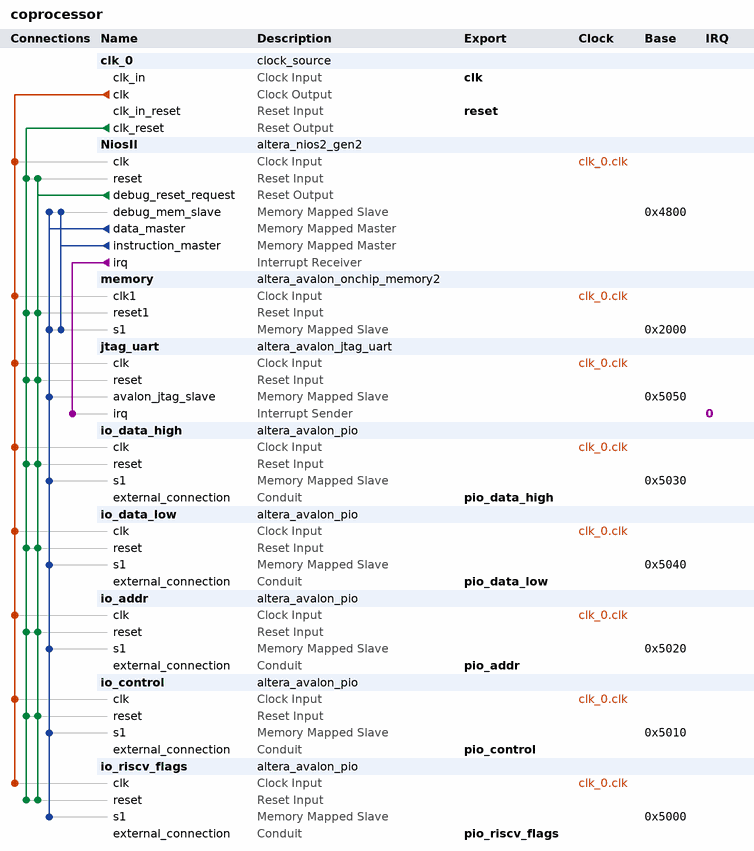
[diagram p0: system contents]
# Platform Designer (Qsys) system coprocessor, Cyclone IV E EP4CE22F17C6
# Parameters at their usual value, and those the tool derives, are not listed.
package require -exact qsys 20.1
create_system coprocessor
set_project_property DEVICE_FAMILY {Cyclone IV E}
set_project_property DEVICE EP4CE22F17C6

add_instance clk_0 clock_source 20.1
set_instance_parameter_value clk_0 clockFrequency 50000000

add_instance NiosII altera_nios2_gen2 20.1
set_instance_parameter_value NiosII dcache_size 2048
set_instance_parameter_value NiosII exceptionSlave memory.s1
set_instance_parameter_value NiosII icache_size 4096
set_instance_parameter_value NiosII impl Tiny
set_instance_parameter_value NiosII resetSlave memory.s1

add_instance memory altera_avalon_onchip_memory2 20.1
set_instance_parameter_value memory dataWidth 32
set_instance_parameter_value memory dualPort false
set_instance_parameter_value memory initMemContent false
set_instance_parameter_value memory initializationFileName onchip_mem.hex
set_instance_parameter_value memory memorySize 6144

add_instance jtag_uart altera_avalon_jtag_uart 20.1
set_instance_parameter_value jtag_uart simInteractiveOptions NO_INTERACTIVE_WINDOWS

add_instance io_data_high altera_avalon_pio 20.1
set_instance_parameter_value io_data_high direction InOut
set_instance_parameter_value io_data_high width 32

add_instance io_data_low altera_avalon_pio 20.1
set_instance_parameter_value io_data_low direction InOut
set_instance_parameter_value io_data_low width 32

add_instance io_addr altera_avalon_pio 20.1
set_instance_parameter_value io_addr direction Output
set_instance_parameter_value io_addr width 15

add_instance io_control altera_avalon_pio 20.1
set_instance_parameter_value io_control direction Output
set_instance_parameter_value io_control resetValue 1
set_instance_parameter_value io_control width 6

add_instance io_riscv_flags altera_avalon_pio 20.1
set_instance_parameter_value io_riscv_flags direction Input
set_instance_parameter_value io_riscv_flags width 2

# connections
add_connection clk_0.clk io_addr.clk clock
add_connection clk_0.clk io_control.clk clock
add_connection clk_0.clk io_data_high.clk clock
add_connection clk_0.clk io_data_low.clk clock
add_connection clk_0.clk io_riscv_flags.clk clock
add_connection clk_0.clk jtag_uart.clk clock
add_connection clk_0.clk memory.clk1 clock
add_connection clk_0.clk NiosII.clk clock
add_connection clk_0.clk_reset io_addr.reset reset
add_connection clk_0.clk_reset io_control.reset reset
add_connection clk_0.clk_reset io_data_high.reset reset
add_connection clk_0.clk_reset io_data_low.reset reset
add_connection clk_0.clk_reset io_riscv_flags.reset reset
add_connection clk_0.clk_reset jtag_uart.reset reset
add_connection clk_0.clk_reset memory.reset1 reset
add_connection clk_0.clk_reset NiosII.reset reset
add_connection NiosII.debug_reset_request io_addr.reset reset
add_connection NiosII.debug_reset_request io_control.reset reset
add_connection NiosII.debug_reset_request io_data_high.reset reset
add_connection NiosII.debug_reset_request io_data_low.reset reset
add_connection NiosII.debug_reset_request io_riscv_flags.reset reset
add_connection NiosII.debug_reset_request jtag_uart.reset reset
add_connection NiosII.debug_reset_request memory.reset1 reset
add_connection NiosII.debug_reset_request NiosII.reset reset
add_connection NiosII.data_master io_addr.s1 avalon
set_connection_parameter_value NiosII.data_master/io_addr.s1 baseAddress 0x5020
add_connection NiosII.data_master io_control.s1 avalon
set_connection_parameter_value NiosII.data_master/io_control.s1 baseAddress 0x5010
add_connection NiosII.data_master io_data_high.s1 avalon
set_connection_parameter_value NiosII.data_master/io_data_high.s1 baseAddress 0x5030
add_connection NiosII.data_master io_data_low.s1 avalon
set_connection_parameter_value NiosII.data_master/io_data_low.s1 baseAddress 0x5040
add_connection NiosII.data_master io_riscv_flags.s1 avalon
set_connection_parameter_value NiosII.data_master/io_riscv_flags.s1 baseAddress 0x5000
add_connection NiosII.data_master jtag_uart.avalon_jtag_slave avalon
set_connection_parameter_value NiosII.data_master/jtag_uart.avalon_jtag_slave baseAddress 0x5050
add_connection NiosII.data_master memory.s1 avalon
set_connection_parameter_value NiosII.data_master/memory.s1 baseAddress 0x2000
add_connection NiosII.data_master NiosII.debug_mem_slave avalon
set_connection_parameter_value NiosII.data_master/NiosII.debug_mem_slave baseAddress 0x4800
add_connection NiosII.instruction_master memory.s1 avalon
set_connection_parameter_value NiosII.instruction_master/memory.s1 baseAddress 0x2000
add_connection NiosII.instruction_master NiosII.debug_mem_slave avalon
set_connection_parameter_value NiosII.instruction_master/NiosII.debug_mem_slave baseAddress 0x4800
add_connection NiosII.irq jtag_uart.irq interrupt
set_connection_parameter_value NiosII.irq/jtag_uart.irq irqNumber 0

# exported interfaces
add_interface clk clock sink
set_interface_property clk EXPORT_OF clk_0.clk_in
add_interface pio_addr conduit end
set_interface_property pio_addr EXPORT_OF io_addr.external_connection
add_interface pio_control conduit end
set_interface_property pio_control EXPORT_OF io_control.external_connection
add_interface pio_data_high conduit end
set_interface_property pio_data_high EXPORT_OF io_data_high.external_connection
add_interface pio_data_low conduit end
set_interface_property pio_data_low EXPORT_OF io_data_low.external_connection
add_interface pio_riscv_flags conduit end
set_interface_property pio_riscv_flags EXPORT_OF io_riscv_flags.external_connection
add_interface reset reset sink
set_interface_property reset EXPORT_OF clk_0.clk_in_reset

set_interconnect_requirement {$system} qsys_mm.clockCrossingAdapter HANDSHAKE
set_interconnect_requirement {$system} qsys_mm.enableEccProtection FALSE
set_interconnect_requirement {$system} qsys_mm.insertDefaultSlave FALSE
set_interconnect_requirement {$system} qsys_mm.maxAdditionalLatency 1

save_system coprocessor.qsys
